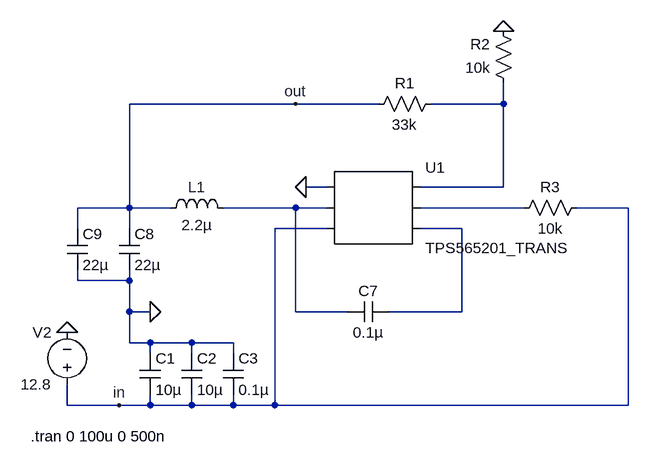
[diagram p0: schematic Voltage_Reg_3-3V.asc]
Voltage_Reg_3-3V.asc, the LTspice schematic file:
Version 4
SHEET 1 880 680
WIRE -160 -16 -416 -16
WIRE -32 -16 -160 -16
WIRE 160 -16 160 -48
WIRE 160 -16 48 -16
WIRE -112 112 -144 112
WIRE 160 112 160 -16
WIRE 160 112 32 112
WIRE -416 144 -416 -16
WIRE -416 144 -496 144
WIRE -352 144 -416 144
WIRE -160 144 -272 144
WIRE -112 144 -160 144
WIRE 192 144 32 144
WIRE 352 144 272 144
WIRE -496 176 -496 144
WIRE -416 176 -416 144
WIRE -112 176 -192 176
WIRE 96 176 32 176
WIRE -496 256 -496 240
WIRE -416 256 -416 240
WIRE -416 256 -496 256
WIRE -416 304 -416 256
WIRE -384 304 -416 304
WIRE -160 304 -160 144
WIRE -80 304 -160 304
WIRE 96 304 96 176
WIRE 96 304 -16 304
WIRE -416 352 -416 304
WIRE -384 352 -416 352
WIRE -320 352 -384 352
WIRE -256 352 -320 352
WIRE -384 368 -384 352
WIRE -320 368 -320 352
WIRE -256 368 -256 352
WIRE -512 448 -512 416
WIRE -432 448 -512 448
WIRE -384 448 -384 432
WIRE -384 448 -432 448
WIRE -320 448 -320 432
WIRE -320 448 -384 448
WIRE -256 448 -256 432
WIRE -256 448 -320 448
WIRE -192 448 -192 176
WIRE -192 448 -256 448
WIRE 352 448 352 144
WIRE 352 448 -192 448
FLAG -144 112 0
FLAG 160 -128 0
FLAG -160 -16 out
FLAG -512 336 0
FLAG -432 448 in
FLAG -384 304 0
SYMBOL AutoGenerated\\TPS565201_TRANS -48 144 R0
SYMATTR InstName U1
SYMBOL ind -368 160 R270
WINDOW 0 32 56 VTop 2
WINDOW 3 5 56 VBottom 2
SYMATTR InstName L1
SYMATTR Value 2.2µ
SYMATTR SpiceLine Rser=1u
SYMBOL cap -400 368 R0
SYMATTR InstName C1
SYMATTR Value 10µ
SYMBOL cap -336 368 R0
SYMATTR InstName C2
SYMATTR Value 10µ
SYMBOL cap -272 368 R0
SYMATTR InstName C3
SYMATTR Value 0.1µ
SYMBOL res 288 128 R90
WINDOW 0 0 56 VBottom 2
WINDOW 3 32 56 VTop 2
SYMATTR InstName R3
SYMATTR Value 10k
SYMBOL res 64 -32 R90
WINDOW 0 0 56 VBottom 2
WINDOW 3 32 56 VTop 2
SYMATTR InstName R1
SYMATTR Value 33k
SYMBOL cap -16 288 R90
WINDOW 0 0 32 VBottom 2
WINDOW 3 32 32 VTop 2
SYMATTR InstName C7
SYMATTR Value 0.1µ
SYMBOL cap -512 176 R0
SYMATTR InstName C9
SYMATTR Value 22µ
SYMBOL cap -432 176 R0
SYMATTR InstName C8
SYMATTR Value 22µ
SYMBOL res 176 -32 R180
WINDOW 0 36 76 Left 2
WINDOW 3 36 40 Left 2
SYMATTR InstName R2
SYMATTR Value 10k
SYMBOL voltage -512 432 R180
WINDOW 0 24 96 Left 2
WINDOW 3 24 16 Left 2
WINDOW 123 0 0 Left 0
WINDOW 39 0 0 Left 0
SYMATTR InstName V2
SYMATTR Value 12.8
TEXT -568 496 Left 2 !.tran 0 100u 0 500n

The netlist it stands for:
* Voltage_Reg_3-3V.asc
* U1: TPS565201_TRANS (symbol AutoGenerated\TPS565201_TRANS not available, pins judged from their places): pin1=0 pin2=N002 pin3=in pin4=N001 pin5=N003 pin6=N004
L1 out N002 2.2µ Rser=1u
C1 0 in 10µ
C2 0 in 10µ
C3 0 in 0.1µ
R3 in N003 10k
R1 N001 out 33k
C7 N004 N002 0.1µ
C9 out 0 22µ
C8 out 0 22µ
R2 N001 0 10k
V2 in 0 12.8
.tran 0 100u 0 500n
.backanno
.end